# Altium project 3CHOE.PrjPcb
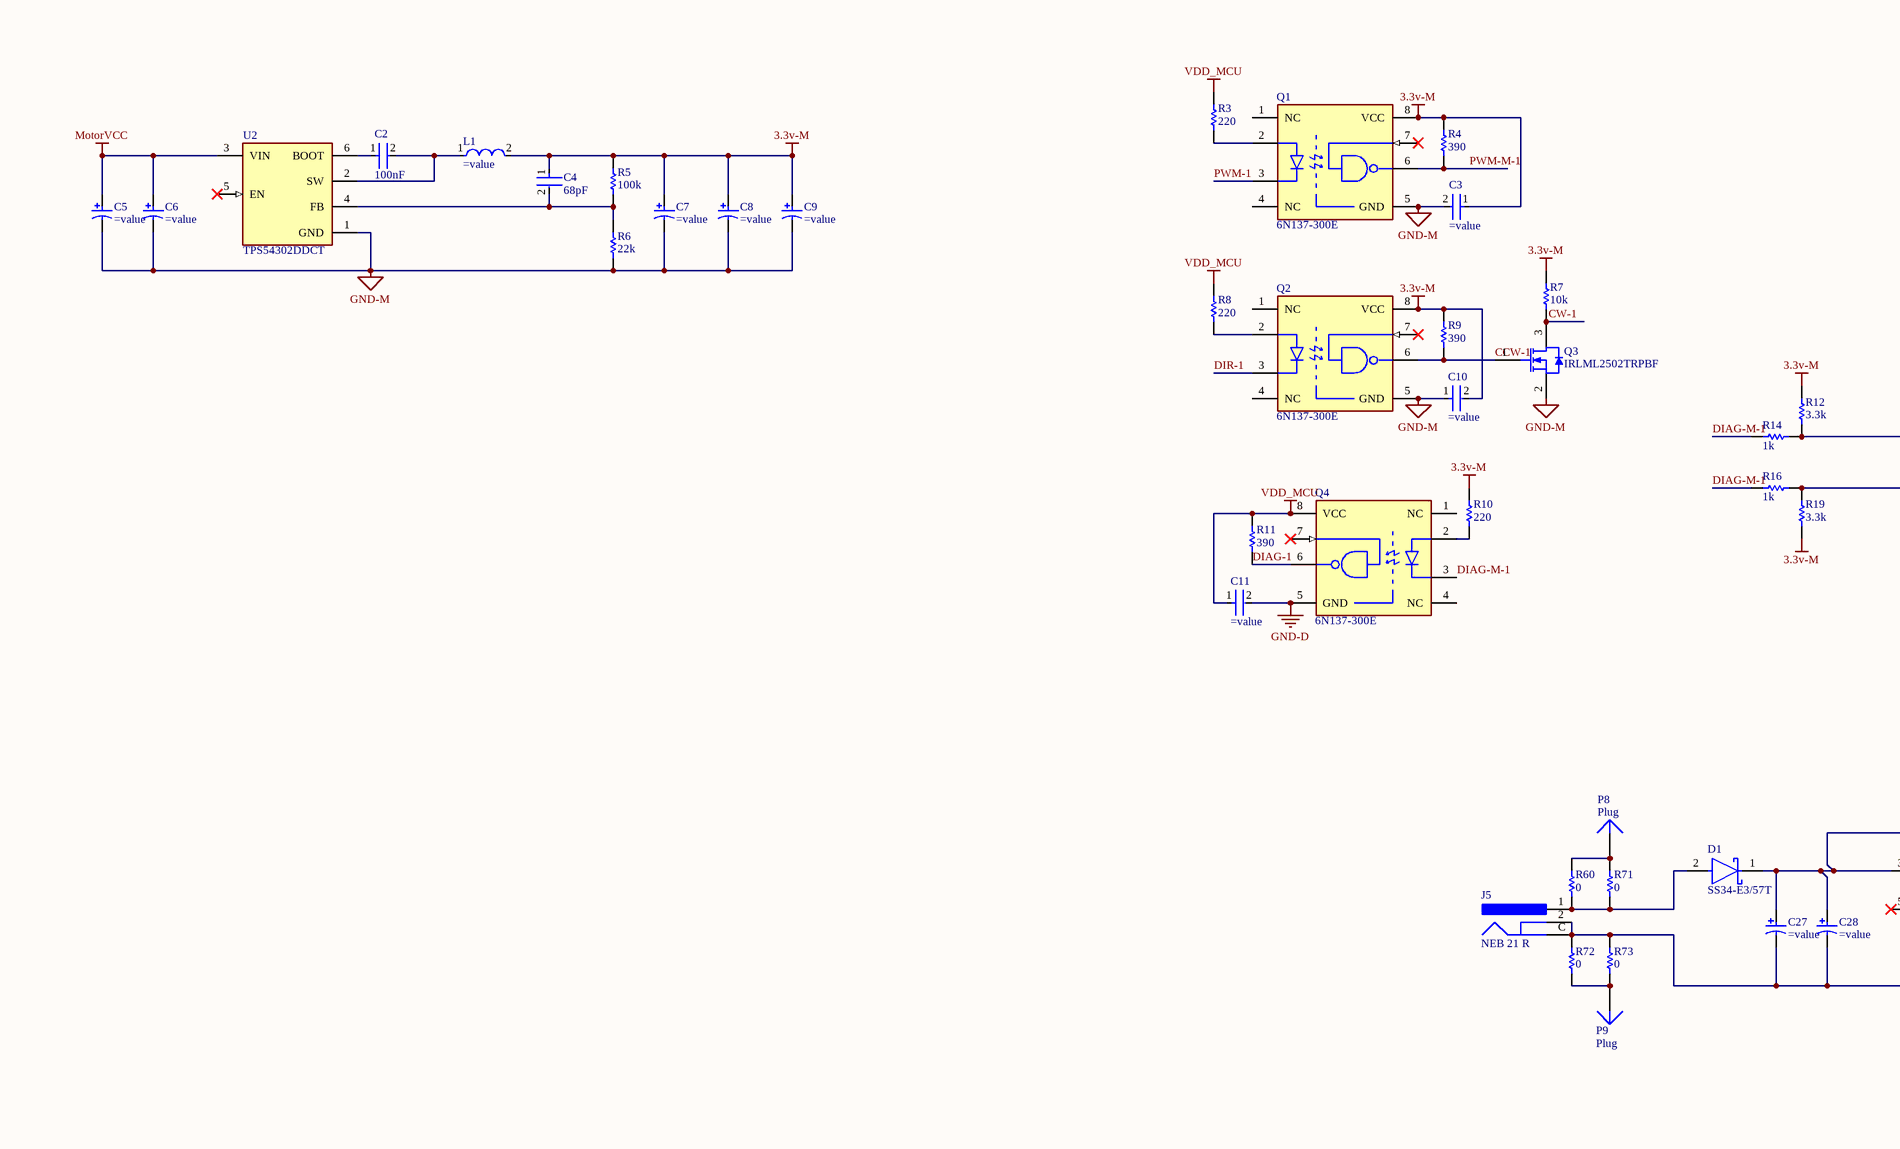
[diagram p0: 3CHOE.SchDoc, top left]
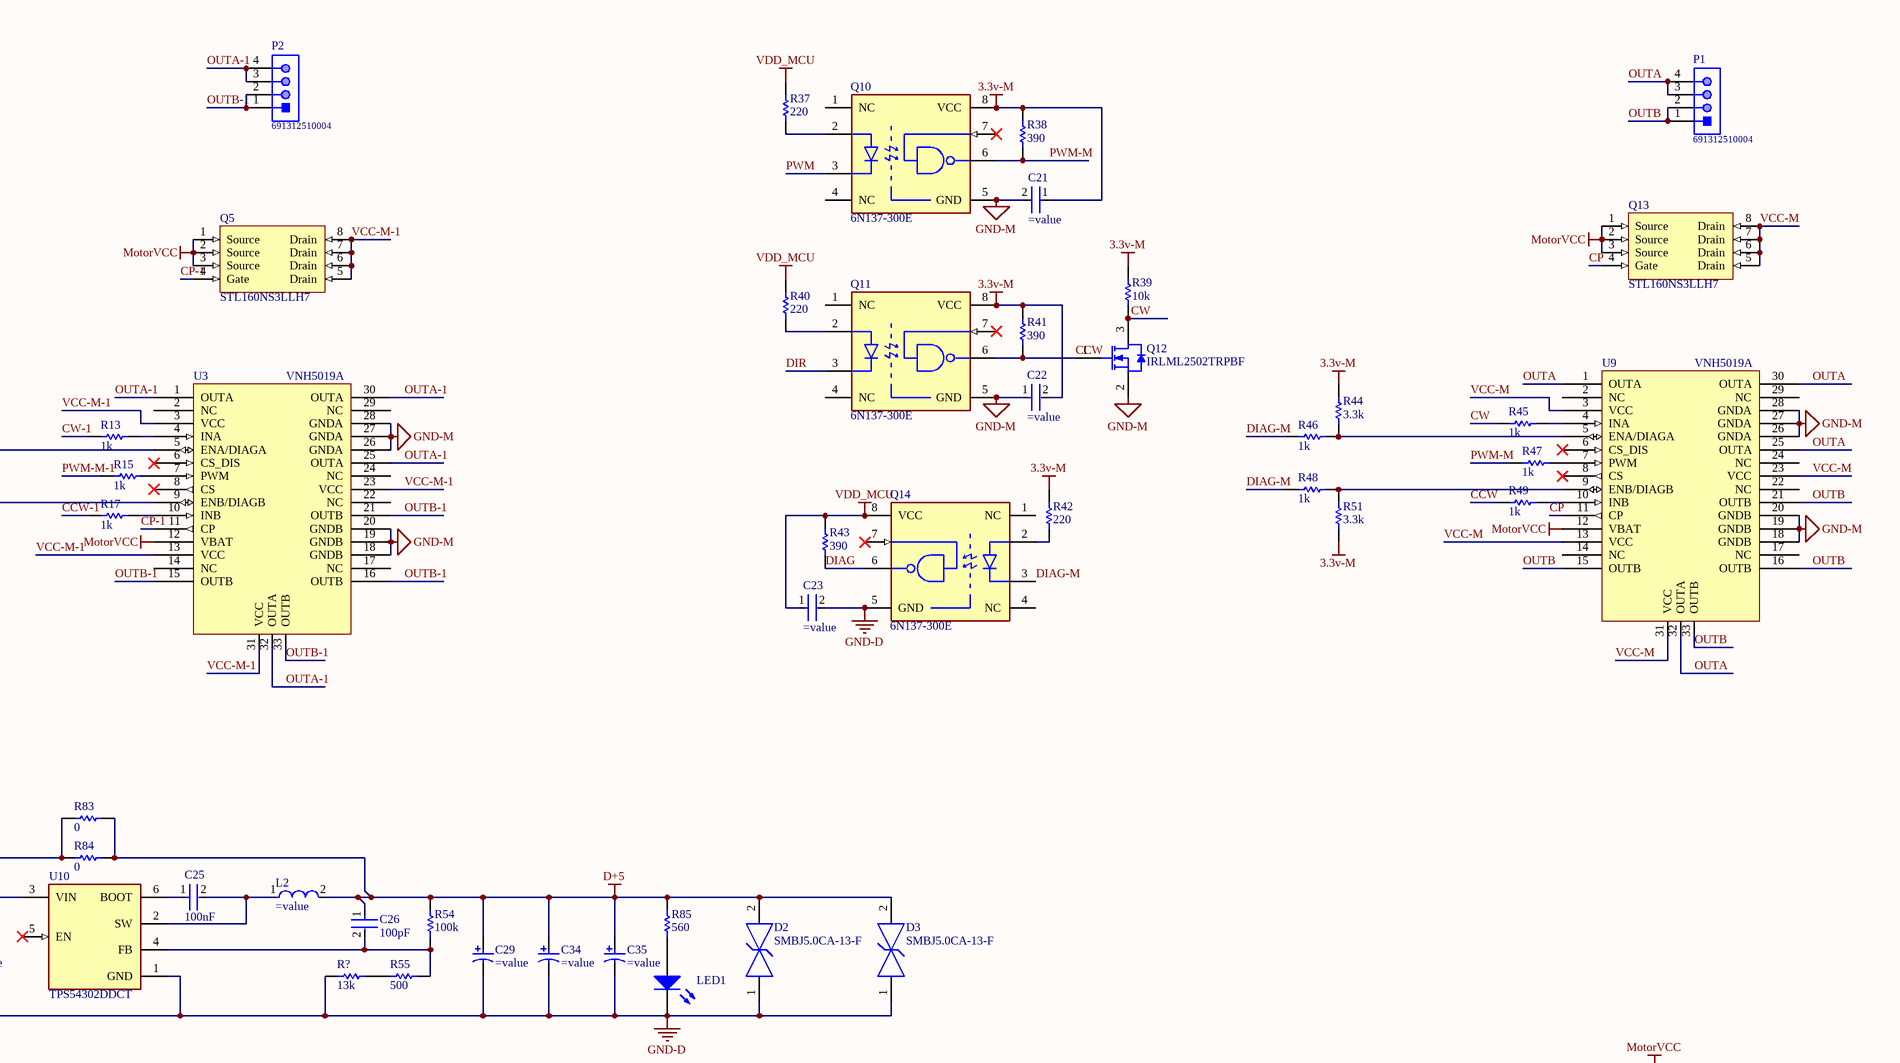
[diagram p1: 3CHOE.SchDoc, top right]
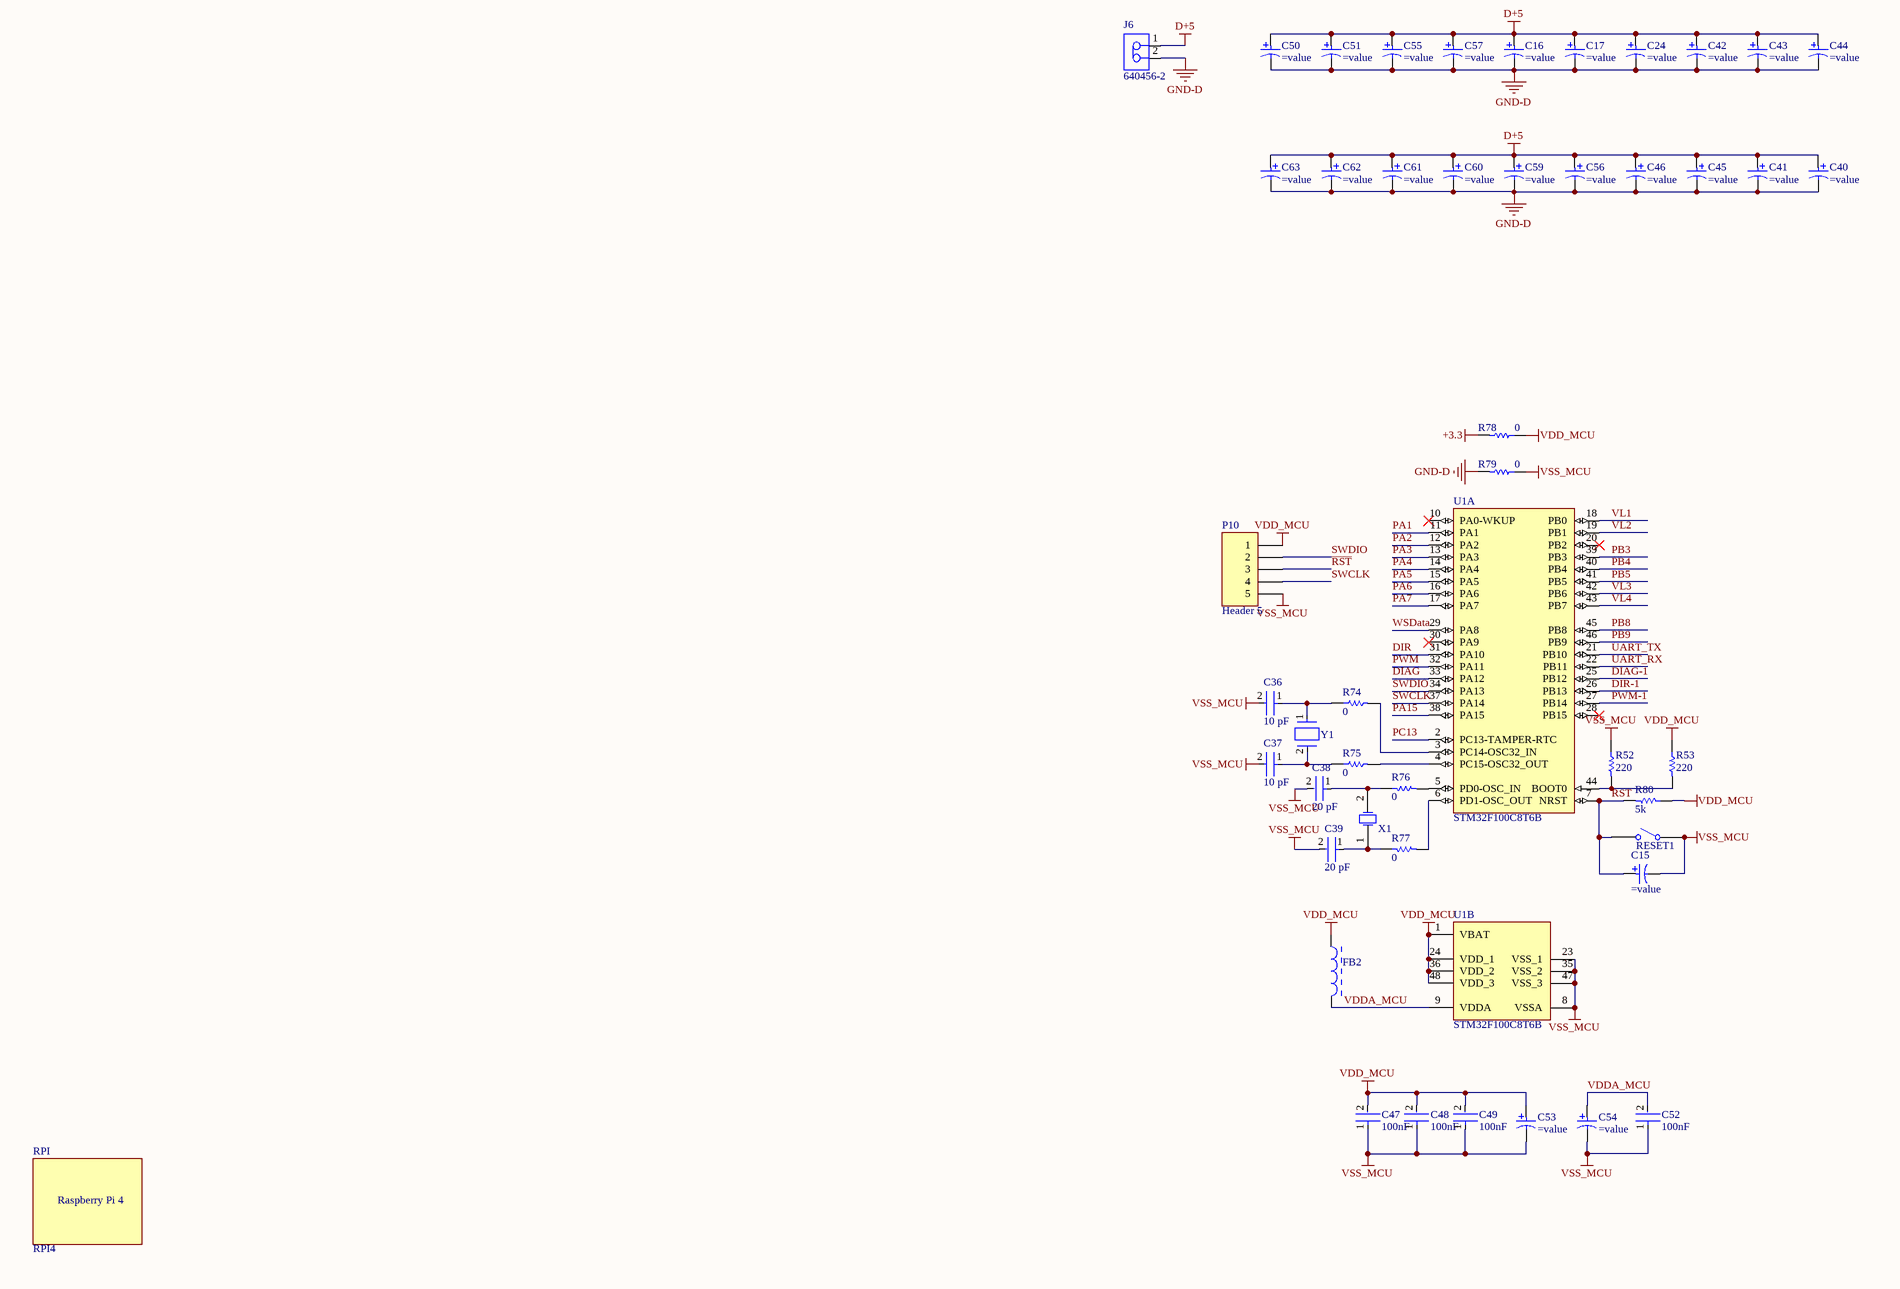
[diagram p2: 3CHOE.SchDoc, bottom left]
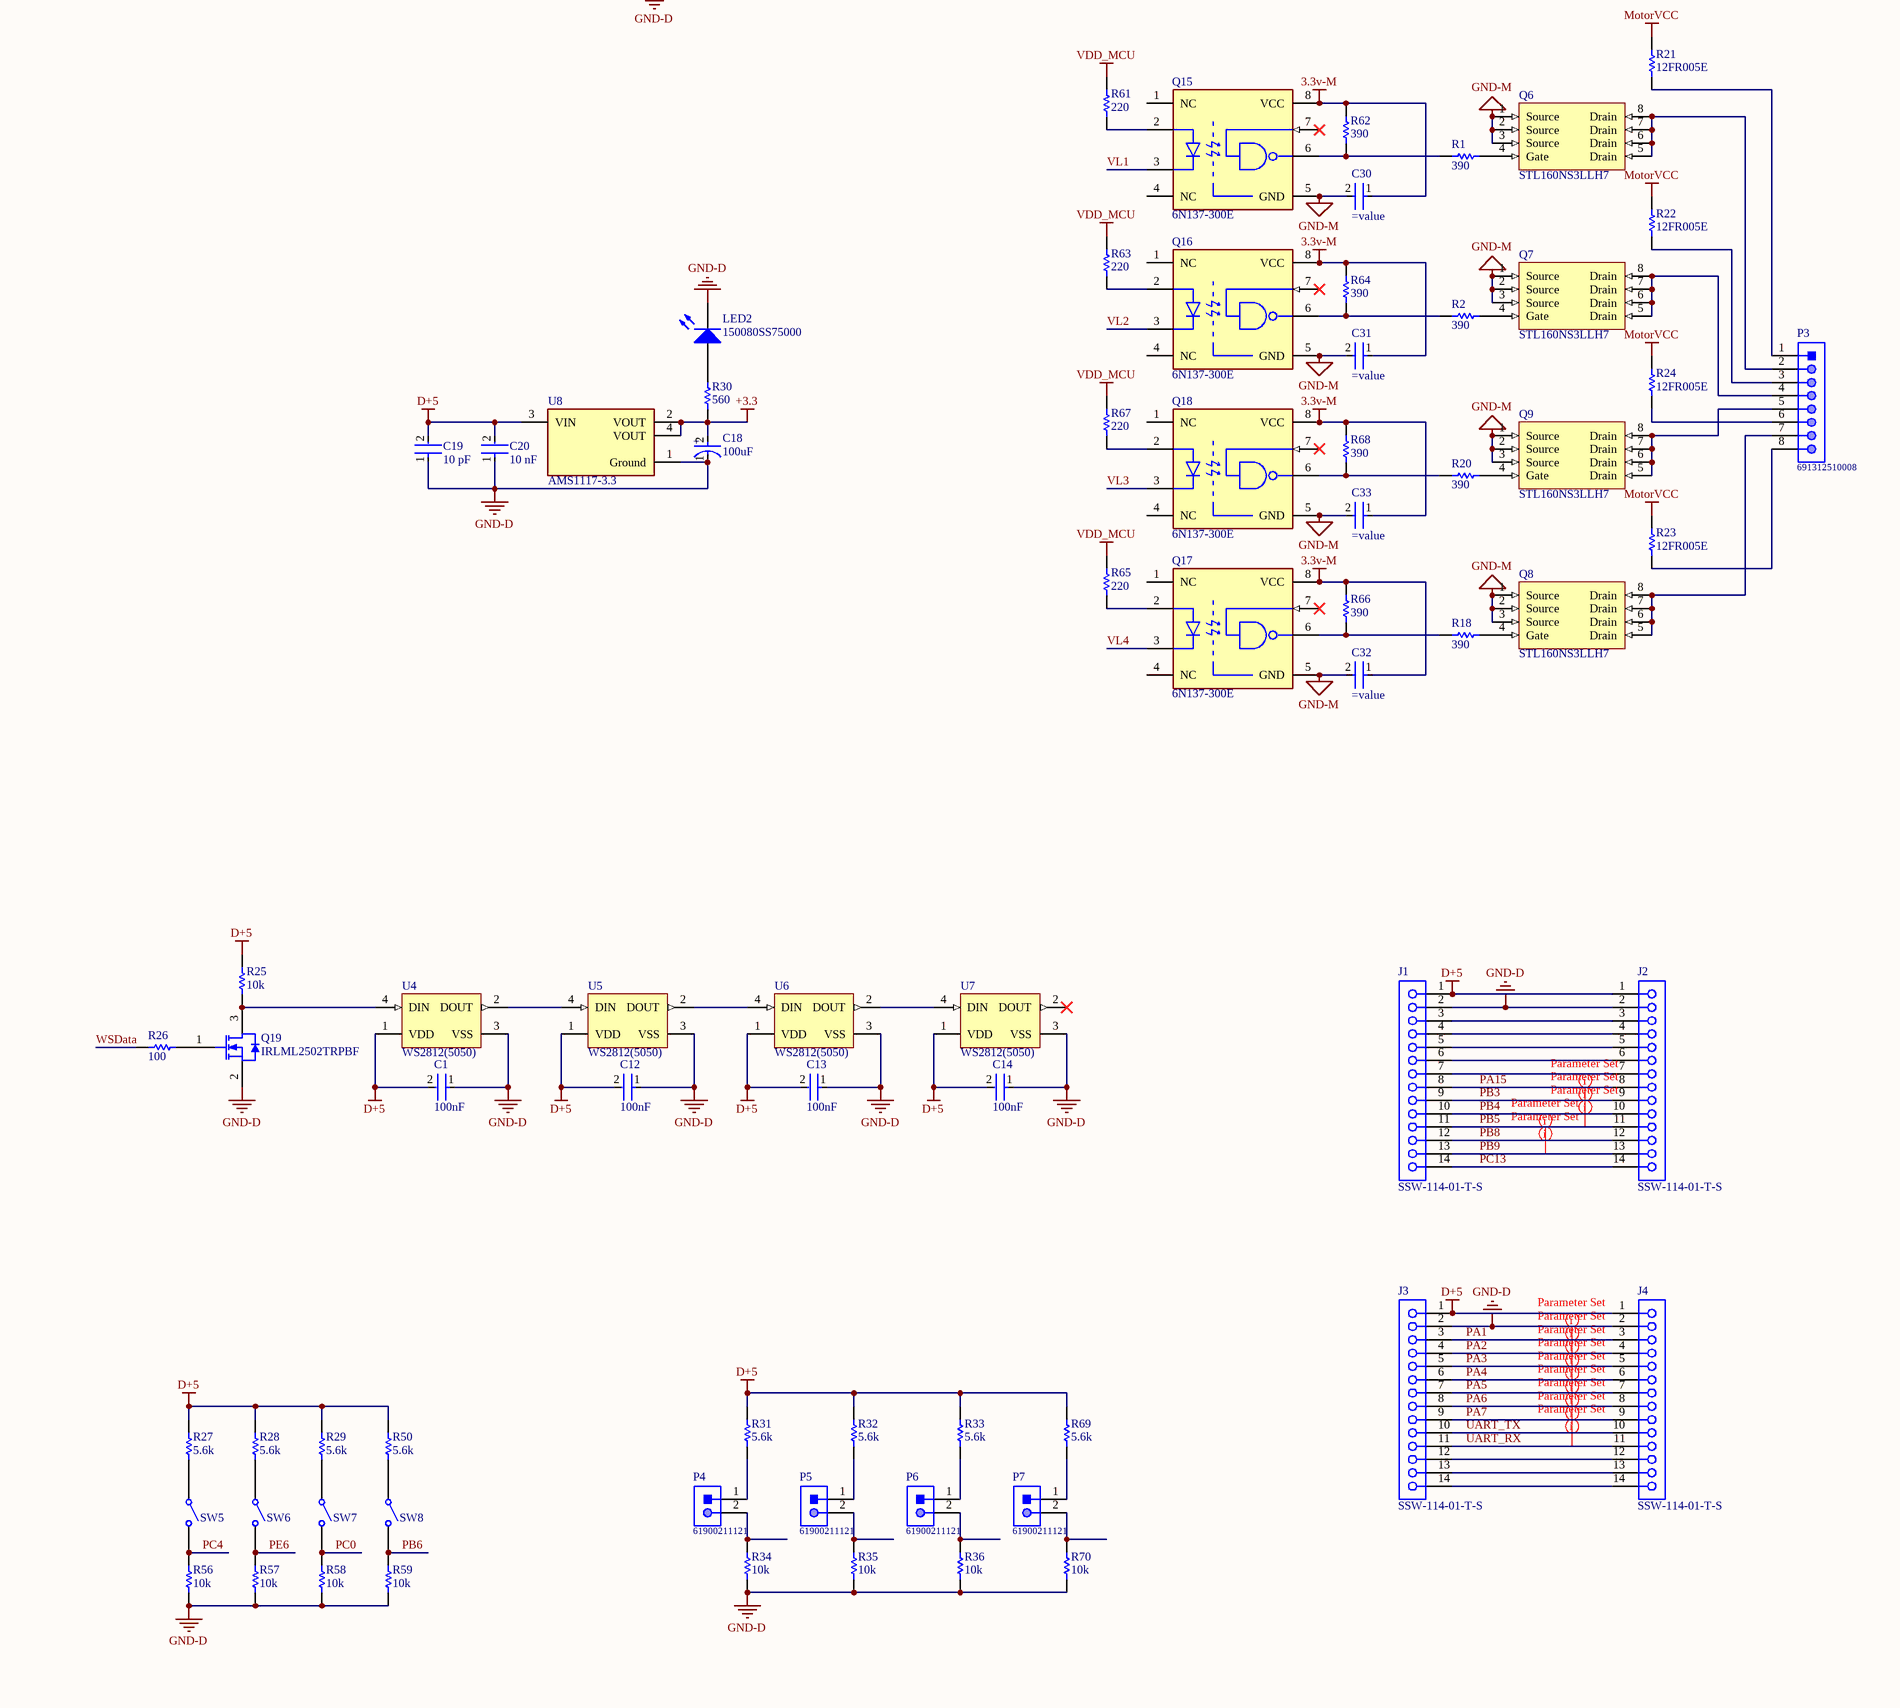
[diagram p3: 3CHOE.SchDoc, bottom right]
1 sheet, 207 parts. Net scope: global (net labels, ports and power ports of the same name join across sheets).
Board file: 3CHOE.PcbDoc

## Sheet 3CHOE.SchDoc
size A1

### Parts
C1  100nF  [FP-C0805C-DN-IPC_A]
C2  100nF  [FP-C0805C-DN-IPC_A]
C3  (no value)  [FP-C0805C-DN-MFG]
C4  68pF  [FP-C0805C-DN-IPC_A]
C5  (no value)  [KEMT-A-3216-18-2_L]
C6  (no value)  [KEMT-A-3216-18-2_L]
C7  (no value)  [KEMT-A-3216-18-2_L]
C8  (no value)  [KEMT-A-3216-18-2_L]
C9  (no value)  [KEMT-A-3216-18-2_L]
C10  (no value)  [FP-C0805C-DN-MFG]
C11  (no value)  [FP-C0805C-DN-MFG]
C12  100nF  [FP-C0805C-DN-IPC_A]
C13  100nF  [FP-C0805C-DN-IPC_A]
C14  100nF  [FP-C0805C-DN-IPC_A]
C15  (no value)  [KEMT-A-3216-18-2_L]
C16  (no value)  [PNSC-FP-V-C_V]
C17  (no value)  [PNSC-FP-V-C_V]
C18  100uF  [FP-TAJD-MFG]
C19  10 pF  [FP-C0805C-DN-MFG]
C20  10 nF  [FP-C0805C-DN-MFG]
C21  (no value)  [FP-C0805C-DN-MFG]
C22  (no value)  [FP-C0805C-DN-MFG]
C23  (no value)  [FP-C0805C-DN-MFG]
C24  (no value)  [PNSC-FP-V-C_V]
C25  100nF  [FP-C0805C-DN-IPC_A]
C26  100pF  [FP-C0805C-DN-IPC_A]
C27  (no value)  [KEMT-A-3216-18-2_L]
C28  (no value)  [KEMT-A-3216-18-2_L]
C29  (no value)  [KEMT-A-3216-18-2_L]
C30  (no value)  [FP-C0805C-DN-MFG]
C31  (no value)  [FP-C0805C-DN-MFG]
C32  (no value)  [FP-C0805C-DN-MFG]
C33  (no value)  [FP-C0805C-DN-MFG]
C34  (no value)  [KEMT-A-3216-18-2_L]
C35  (no value)  [KEMT-A-3216-18-2_L]
C36  10 pF  [FP-C0805C-DN-IPC_A]
C37  10 pF  [FP-C0805C-DN-IPC_A]
C38  20 pF  [FP-C0805C-DN-IPC_A]
C39  20 pF  [FP-C0805C-DN-IPC_A]
C40  (no value)  [PNSC-FP-V-C_V]
C41  (no value)  [PNSC-FP-V-C_V]
C42  (no value)  [PNSC-FP-V-C_V]
C43  (no value)  [PNSC-FP-V-C_V]
C44  (no value)  [PNSC-FP-V-C_V]
C45  (no value)  [PNSC-FP-V-C_V]
C46  (no value)  [PNSC-FP-V-C_V]
C47  100nF  [FP-C0805C-DN-IPC_A]
C48  100nF  [FP-C0805C-DN-IPC_A]
C49  100nF  [FP-C0805C-DN-IPC_A]
C50  (no value)  [PNSC-FP-V-C_V]
C51  (no value)  [PNSC-FP-V-C_V]
C52  100nF  [FP-C0805C-DN-IPC_A]
C53  (no value)  [KEMT-A-3216-18-2_L]
C54  (no value)  [KEMT-A-3216-18-2_L]
C55  (no value)  [PNSC-FP-V-C_V]
C56  (no value)  [PNSC-FP-V-C_V]
C57  (no value)  [PNSC-FP-V-C_V]
C59  (no value)  [PNSC-FP-V-C_V]
C60  (no value)  [PNSC-FP-V-C_V]
C61  (no value)  [PNSC-FP-V-C_V]
C62  (no value)  [PNSC-FP-V-C_V]
C63  (no value)  [PNSC-FP-V-C_V]
D1  SS34-E3/57T  [FP-95402-MFG]
D2  SMBJ5.0CA-13-F  [FP-SMB-CA-MFG]
D3  SMBJ5.0CA-13-F  [FP-SMB-CA-MFG]
FB2  BLM21RK121SN1D  [MURA-BLM21-H1-CHIP-2_V]  (value not drawn)
J1  SSW-114-01-T-S  [SMTC-SSW-114-01-X-S]
J2  SSW-114-01-T-S  [SMTC-SSW-114-01-X-S]
J3  SSW-114-01-T-S  [SMTC-SSW-114-01-X-S]
J4  SSW-114-01-T-S  [SMTC-SSW-114-01-X-S]
J5  NEB 21 R  [LUMB-NEB21R_V]
J6  640456-2  [TECO-640456-2_V]
L1  (no value)  [FP-IHLP-2525CZ-FP_2_413x3-MFG]
L2  (no value)  [FP-IHLP-2525CZ-FP_2_413x3-MFG]
LED1  150080SS75000  [0805_A]  (value not drawn)
LED2  150080SS75000  [0805_A]
P1  691312510004  [691312510004]
P2  691312510004  [691312510004]
P3  691312510008  [691312510008]
P4  61900211121  [61900211121]
P5  61900211121  [61900211121]
P6  61900211121  [61900211121]
P7  61900211121  [61900211121]
P8  Plug  [Screw-5-3.3]
P9  Plug  [Screw-5-3.3]
P10  Header 5  [STM32 PR]
Q1  6N137-300E  [FP-6N137-300E-MFG]
Q2  6N137-300E  [FP-6N137-300E-MFG]
Q3  IRLML2502TRPBF  [INTR-SOT-23-3_V]
Q4  6N137-300E  [FP-6N137-300E-MFG]
Q5  STL160NS3LLH7  [PowerFLAT™ 5x6 WF]
Q6  STL160NS3LLH7  [PowerFLAT™ 5x6 WF]
Q7  STL160NS3LLH7  [PowerFLAT™ 5x6 WF]
Q8  STL160NS3LLH7  [PowerFLAT™ 5x6 WF]
Q9  STL160NS3LLH7  [PowerFLAT™ 5x6 WF]
Q10  6N137-300E  [FP-6N137-300E-MFG]
Q11  6N137-300E  [FP-6N137-300E-MFG]
Q12  IRLML2502TRPBF  [INTR-SOT-23-3_V]
Q13  STL160NS3LLH7  [PowerFLAT™ 5x6 WF]
Q14  6N137-300E  [FP-6N137-300E-MFG]
Q15  6N137-300E  [FP-6N137-300E-MFG]
Q16  6N137-300E  [FP-6N137-300E-MFG]
Q17  6N137-300E  [FP-6N137-300E-MFG]
Q18  6N137-300E  [FP-6N137-300E-MFG]
Q19  IRLML2502TRPBF  [INTR-SOT-23-3_V]
R1  390  [RESC2013X60X35NL10T20]
R2  390  [RESC2013X60X35NL10T20]
R3  220  [RESC2013X60X35NL10T20]
R4  390  [RESC2013X60X35NL10T20]
R5  100k  [RESC2013X60X35NL10T20]
R6  22k  [RESC2013X60X35NL10T20]
R7  10k  [RESC2013X60X35NL10T20]
R8  220  [RESC2013X60X35NL10T20]
R9  390  [RESC2013X60X35NL10T20]
R10  220  [RESC2013X60X35NL10T20]
R11  390  [RESC2013X60X35NL10T20]
R12  3.3k  [RESC2013X60X35NL10T20]
R13  1k  [RESC2013X60X35NL10T20]
R14  1k  [RESC2013X60X35NL10T20]
R15  1k  [RESC2013X60X35NL10T20]
R16  1k  [RESC2013X60X35NL10T20]
R17  1k  [RESC2013X60X35NL10T20]
R18  390  [RESC2013X60X35NL10T20]
R19  3.3k  [RESC2013X60X35NL10T20]
R20  390  [RESC2013X60X35NL10T20]
R21  12FR005E  [RESA90-1060X240]
R22  12FR005E  [RESA90-1060X240]
R23  12FR005E  [RESA90-1060X240]
R24  12FR005E  [RESA90-1060X240]
R25  10k  [RESC2013X60X35NL10T20]
R26  100  [RESC2013X60X35NL10T20]
R27  5.6k  [RESC2013X60X35NL10T20]
R28  5.6k  [RESC2013X60X35NL10T20]
R29  5.6k  [RESC2013X60X35NL10T20]
R30  560  [RESC2013X60X35NL10T20]
R31  5.6k  [RESC2013X60X35NL10T20]
R32  5.6k  [RESC2013X60X35NL10T20]
R33  5.6k  [RESC2013X60X35NL10T20]
R34  10k  [RESC2013X60X35NL10T20]
R35  10k  [RESC2013X60X35NL10T20]
R36  10k  [RESC2013X60X35NL10T20]
R37  220  [RESC2013X60X35NL10T20]
R38  390  [RESC2013X60X35NL10T20]
R39  10k  [RESC2013X60X35NL10T20]
R40  220  [RESC2013X60X35NL10T20]
R41  390  [RESC2013X60X35NL10T20]
R42  220  [RESC2013X60X35NL10T20]
R43  390  [RESC2013X60X35NL10T20]
R44  3.3k  [RESC2013X60X35NL10T20]
R45  1k  [RESC2013X60X35NL10T20]
R46  1k  [RESC2013X60X35NL10T20]
R47  1k  [RESC2013X60X35NL10T20]
R48  1k  [RESC2013X60X35NL10T20]
R49  1k  [RESC2013X60X35NL10T20]
R50  5.6k  [RESC2013X60X35NL10T20]
R51  3.3k  [RESC2013X60X35NL10T20]
R52  220  [RESC2013X60X35NL10T20]
R53  220  [RESC2013X60X35NL10T20]
R54  100k  [RESC2013X60X35NL10T20]
R55  500  [RESC2013X60X35NL10T20]
R56  10k  [RESC2013X60X35NL10T20]
R57  10k  [RESC2013X60X35NL10T20]
R58  10k  [RESC2013X60X35NL10T20]
R59  10k  [RESC2013X60X35NL10T20]
R60  0  [RESC2013X60X35NL10T20]
R61  220  [RESC2013X60X35NL10T20]
R62  390  [RESC2013X60X35NL10T20]
R63  220  [RESC2013X60X35NL10T20]
R64  390  [RESC2013X60X35NL10T20]
R65  220  [RESC2013X60X35NL10T20]
R66  390  [RESC2013X60X35NL10T20]
R67  220  [RESC2013X60X35NL10T20]
R68  390  [RESC2013X60X35NL10T20]
R69  5.6k  [RESC2013X60X35NL10T20]
R70  10k  [RESC2013X60X35NL10T20]
R71  0  [RESC2013X60X35NL10T20]
R72  0  [RESC2013X60X35NL10T20]
R73  0  [RESC2013X60X35NL10T20]
R74  0  [RESC2013X60X35NL10T20]
R75  0  [RESC2013X60X35NL10T20]
R76  0  [RESC2013X60X35NL10T20]
R77  0  [RESC2013X60X35NL10T20]
R78  0  [RESC2013X60X35NL10T20]
R79  0  [RESC2013X60X35NL10T20]
R80  5k  [RESC2013X60X35NL10T20]
R83  0  [RESC2013X60X35NL10T20]
R84  0  [RESC2013X60X35NL10T20]
R85  560  [RESC2013X60X35NL10T20]
R?  13k  [RESC2013X60X35NL10T20]
RESET1  434113025826  [434113025826]  (value not drawn)
RPI  RPI4  [Rpi4]
SW5  434113025826  [434113025826]  (value not drawn)
SW6  434113025826  [434113025826]  (value not drawn)
SW7  434113025826  [434113025826]  (value not drawn)
SW8  434113025826  [434113025826]  (value not drawn)
U1  STM32F100C8T6B  [STM-LQFP48_L]  (parts A,B of 2)
U2  TPS54302DDCT  [FP-DDC0006A-MFG]
U3  VNH5019A  [MultiPowerSO-30]
U4  WS2812(5050)  [ADA-RGB-1655_V]
U5  WS2812(5050)  [ADA-RGB-1655_V]
U6  WS2812(5050)  [ADA-RGB-1655_V]
U7  WS2812(5050)  [ADA-RGB-1655_V]
U8  AMS1117-3.3  [FP-AMS1117-IPC_C]
U9  VNH5019A  [MultiPowerSO-30]
U10  TPS54302DDCT  [FP-DDC0006A-MFG]
X1  ATS16ASM-1  [CTS-ATS-SM-XTAL-2]  (value not drawn)
Y1  9HT10-32.768KDZY-T  [FP-9HT10-MFG]  (value not drawn)

### Nets
3.3v-M: C3.1 C4.1 C7.1 C8.1 C9.1 C10.2 C21.1 C22.2 C30.1 C31.1 C32.1 C33.1 L1.2 Q1.8(VCC) Q2.8(VCC) Q10.8(VCC) Q11.8(VCC) Q15.8(VCC) Q16.8(VCC) Q17.8(VCC) Q18.8(VCC) R4.2 R5.1 R7.2 R9.2 R10.1 R12.1 R19.1 R38.2 R39.2 R41.2 R42.1 R44.1 R51.1 R62.2 R64.2 R66.2 R68.2
+3.3: C18.2(A) R30.2 R78.2 U8.2(VOUT) U8.4(VOUT)
D+5: C1.2 C12.2 C13.2 C14.2 C16.1 C17.1 C19.2 C20.2 C24.1 C26.1 C29.1 C34.1 C35.1 C40.1 C41.1 C42.1 C43.1 C44.1 C45.1 C46.1 C50.1 C51.1 C55.1 C56.1 C57.1 C59.1 C60.1 C61.1 C62.1 C63.1 D2.2 D3.2 J1.1 J2.1 J3.1 J4.1 J6.1 L2.2 R25.2 R27.2 R28.2 R29.2 R31.2 R32.2 R33.2 R50.2 R54.1 R69.2 R83.2 R84.2 R85.2 U4.1(VDD) U5.1(VDD) U6.1(VDD) U7.1(VDD) U8.3(VIN)
GND-D: C1.1 C11.2 C12.1 C13.1 C14.1 C16.2 C17.2 C18.1(C) C19.1 C20.1 C23.2 C24.2 C27.2 C28.2 C29.2 C34.2 C35.2 C40.2 C41.2 C42.2 C43.2 C44.2 C45.2 C46.2 C50.2 C51.2 C55.2 C56.2 C57.2 C59.2 C60.2 C61.2 C62.2 C63.2 D2.1 D3.1 J1.2 J2.2 J3.2 J4.2 J5.2 J5.C J6.2 LED1.1(K) LED2.1(K) Q4.5(GND) Q14.5(GND) Q19.2(S) R34.1 R35.1 R36.1 R56.1 R57.1 R58.1 R59.1 R70.1 R72.1 R73.1 R79.2 R?.1 U4.3(VSS) U5.3(VSS) U6.3(VSS) U7.3(VSS) U8.1(Ground) U10.1(GND)
GND-M: C3.2 C5.2 C6.2 C7.2 C8.2 C9.2 C10.1 C21.2 C22.1 C30.2 C31.2 C32.2 C33.2 Q1.5(GND) Q2.5(GND) Q3.2(S) Q6.1(Source) Q6.2(Source) Q6.3(Source) Q7.1(Source) Q7.2(Source) Q7.3(Source) Q8.1(Source) Q8.2(Source) Q8.3(Source) Q9.1(Source) Q9.2(Source) Q9.3(Source) Q10.5(GND) Q11.5(GND) Q12.2(S) Q15.5(GND) Q16.5(GND) Q17.5(GND) Q18.5(GND) R6.2 U2.1(GND) U3.18(GNDB) U3.19(GNDB) U3.20(GNDB) U3.26(GNDA) U3.27(GNDA) U3.28(GNDA) U9.18(GNDB) U9.19(GNDB) U9.20(GNDB) U9.26(GNDA) U9.27(GNDA) U9.28(GNDA)
MotorVCC: C5.1 C6.1 Q5.1(Source) Q5.2(Source) Q5.3(Source) Q13.1(Source) Q13.2(Source) Q13.3(Source) R21.2 R22.2 R23.2 R24.2 U2.3(VIN) U3.12(VBAT) U9.12(VBAT)
VDD_MCU: C11.1 C23.1 C47.2 C48.2 C49.2 C53.1 FB2.1 P10.1 Q4.8(VCC) Q14.8(VCC) R3.1 R8.1 R11.1 R37.1 R40.1 R43.1 R53.1 R61.1 R63.1 R65.1 R67.1 R78.1 R80.1 U1.1(VBAT) U1.24(VDD_1) U1.36(VDD_2) U1.48(VDD_3)
VSS_MCU: C15.2 C36.2 C37.2 C38.2 C39.2 C47.1 C48.1 C49.1 C52.1 C53.2 C54.2 P10.5 R52.1 R79.1 RESET1.1 U1.8(VSSA) U1.23(VSS_1) U1.35(VSS_2) U1.47(VSS_3)
~{RST}: C15.1 P10.3 R80.2 RESET1.2 U1.7(NRST)
CCW: Q11.6(VO) Q12.1(G) R41.1 R49.2
CCW-1: Q2.6(VO) Q3.1(G) R9.1 R17.2
CP: Q13.4(Gate) U9.11(CP)
CP-1: Q5.4(Gate) U3.11(CP)
CW: Q12.3(D) R39.1 R45.2
CW-1: Q3.3(D) R7.1 R13.2
DIAG: Q14.6(VO) R43.2 U1.33(PA12)
DIAG-1: Q4.6(VO) R11.2 U1.25(PB12)
DIAG-M: Q14.3(C) R46.2 R48.2
DIAG-M-1: Q4.3(C) R14.2 R16.2
DIR: Q11.3(C) U1.31(PA10)
DIR-1: Q2.3(C) U1.26(PB13)
OUTA: P1.3 P1.4 U9.1(OUTA) U9.25(OUTA) U9.30(OUTA) U9.32(OUTA)
OUTA-1: P2.3 P2.4 U3.1(OUTA) U3.25(OUTA) U3.30(OUTA) U3.32(OUTA)
OUTB: P1.1 P1.2 U9.15(OUTB) U9.16(OUTB) U9.21(OUTB) U9.33(OUTB)
OUTB-1: P2.1 P2.2 U3.15(OUTB) U3.16(OUTB) U3.21(OUTB) U3.33(OUTB)
PA1: J3.3 J4.3 U1.11(PA1)
PA2: J3.4 J4.4 U1.12(PA2)
PA3: J3.5 J4.5 U1.13(PA3)
PA4: J3.6 J4.6 U1.14(PA4)
PA5: J3.7 J4.7 U1.15(PA5)
PA6: J3.8 J4.8 U1.16(PA6)
PA7: J3.9 J4.9 U1.17(PA7)
PA15: J1.8 J2.8 U1.38(PA15)
PB3: J1.9 J2.9 U1.39(PB3)
PB4: J1.10 J2.10 U1.40(PB4)
PB5: J1.11 J2.11 U1.41(PB5)
PB6: R59.2 SW8.2
PB8: J1.12 J2.12 U1.45(PB8)
PB9: J1.13 J2.13 U1.46(PB9)
PC0: R58.2 SW7.2
PC4: R56.2 SW5.2
PC13: J1.14 J2.14 U1.2(PC13-TAMPER-RTC)
PE6: R57.2 SW6.2
PWM: Q10.3(C) U1.32(PA11)
PWM-1: Q1.3(C) U1.27(PB14)
PWM-M: Q10.6(VO) R38.1 R47.2
PWM-M-1: Q1.6(VO) R4.1 R15.2
SWCLK: P10.4 U1.37(PA14)
SWDIO: P10.2 U1.34(PA13)
UART_RX: J3.11 J4.11 U1.22(PB11)
UART_TX: J3.10 J4.10 U1.21(PB10)
VCC-M: Q13.5(Drain) Q13.6(Drain) Q13.7(Drain) Q13.8(Drain) U9.3(VCC) U9.13(VCC) U9.23(VCC) U9.31(VCC)
VCC-M-1: Q5.5(Drain) Q5.6(Drain) Q5.7(Drain) Q5.8(Drain) U3.3(VCC) U3.13(VCC) U3.23(VCC) U3.31(VCC)
VDDA_MCU: C52.2 C54.1 FB2.2 U1.9(VDDA)
VL1: Q15.3(C) U1.18(PB0)
VL2: Q16.3(C) U1.19(PB1)
VL3: Q18.3(C) U1.42(PB6)
VL4: Q17.3(C) U1.43(PB7)
WSData: R26.2 U1.29(PA8)
NetC2_1: C2.1 U2.6(BOOT)
NetC2_2: C2.2 L1.1 U2.2(SW)
NetC4_2: C4.2 R5.2 R6.1 U2.4(FB)
NetC25_1: C25.1 U10.6(BOOT)
NetC25_2: C25.2 L2.1 U10.2(SW)
NetC26_2: C26.2 R54.2 R55.2 U10.4(FB)
NetC27_1: C27.1 C28.1 D1.1(C) R83.1 R84.1 U10.3(VIN)
NetC36_1: C36.1 R74.1 Y1.1
NetC37_1: C37.1 R75.1 Y1.2
NetC38_1: C38.1 R76.1 X1.2(X2)
NetC39_1: C39.1 R77.1 X1.1(X1)
NetD1_2: D1.2(A) J5.1 R60.2 R71.2
NetJ1_3: J1.3 J2.3
NetJ1_4: J1.4 J2.4
NetJ1_5: J1.5 J2.5
NetJ1_6: J1.6 J2.6
NetJ1_7: J1.7 J2.7
NetJ3_12: J3.12 J4.12
NetJ3_13: J3.13 J4.13
NetJ3_14: J3.14 J4.14
NetLED1_2: LED1.2(A) R85.1
NetLED2_2: LED2.2(A) R30.1
NetP3_1: P3.1 R21.1
NetP3_2: P3.2 Q6.5(Drain) Q6.6(Drain) Q6.7(Drain) Q6.8(Drain)
NetP3_3: P3.3 R22.1
NetP3_4: P3.4 Q7.5(Drain) Q7.6(Drain) Q7.7(Drain) Q7.8(Drain)
NetP3_5: P3.5 Q9.5(Drain) Q9.6(Drain) Q9.7(Drain) Q9.8(Drain)
NetP3_6: P3.6 R24.1
NetP3_7: P3.7 Q8.5(Drain) Q8.6(Drain) Q8.7(Drain) Q8.8(Drain)
NetP3_8: P3.8 R23.1
NetP4_1: P4.1 R31.1
NetP4_2: P4.2 R34.2
NetP5_1: P5.1 R32.1
NetP5_2: P5.2 R35.2
NetP6_1: P6.1 R33.1
NetP6_2: P6.2 R36.2
NetP7_1: P7.1 R69.1
NetP7_2: P7.2 R70.2
NetP8_1: P8.1 R60.1 R71.1
NetP9_1: P9.1 R72.2 R73.2
NetQ1_2: Q1.2(A) R3.2
NetQ2_2: Q2.2(A) R8.2
NetQ4_2: Q4.2(A) R10.2
NetQ6_4: Q6.4(Gate) R1.1
NetQ7_4: Q7.4(Gate) R2.1
NetQ8_4: Q8.4(Gate) R18.1
NetQ9_4: Q9.4(Gate) R20.1
NetQ10_2: Q10.2(A) R37.2
NetQ11_2: Q11.2(A) R40.2
NetQ14_2: Q14.2(A) R42.2
NetQ15_2: Q15.2(A) R61.2
NetQ15_6: Q15.6(VO) R1.2 R62.1
NetQ16_2: Q16.2(A) R63.2
NetQ16_6: Q16.6(VO) R2.2 R64.1
NetQ17_2: Q17.2(A) R65.2
NetQ17_6: Q17.6(VO) R18.2 R66.1
NetQ18_2: Q18.2(A) R67.2
NetQ18_6: Q18.6(VO) R20.2 R68.1
NetQ19_1: Q19.1(G) R26.1
NetQ19_3: Q19.3(D) R25.1 U4.4(DIN)
NetR12_2: R12.2 R14.1 U3.5(ENA/DIAGA)
NetR13_1: R13.1 U3.4(INA)
NetR15_1: R15.1 U3.7(PWM)
NetR16_1: R16.1 R19.2 U3.9(ENB/DIAGB)
NetR17_1: R17.1 U3.10(INB)
NetR27_1: R27.1 SW5.1
NetR28_1: R28.1 SW6.1
NetR29_1: R29.1 SW7.1
NetR44_2: R44.2 R46.1 U9.5(ENA/DIAGA)
NetR45_1: R45.1 U9.4(INA)
NetR47_1: R47.1 U9.7(PWM)
NetR48_1: R48.1 R51.2 U9.9(ENB/DIAGB)
NetR49_1: R49.1 U9.10(INB)
NetR50_1: R50.1 SW8.1
NetR52_2: R52.2 R53.2 U1.44(BOOT0)
NetR55_1: R55.1 R?.2
NetR74_2: R74.2 U1.3(PC14-OSC32_IN)
NetR75_2: R75.2 U1.4(PC15-OSC32_OUT)
NetR76_2: R76.2 U1.5(PD0-OSC_IN)
NetR77_2: R77.2 U1.6(PD1-OSC_OUT)
NetU4_2: U4.2(DOUT) U5.4(DIN)
NetU5_2: U5.2(DOUT) U6.4(DIN)
NetU6_2: U6.2(DOUT) U7.4(DIN)

Not connected (* = marked no-connect by the designer): Q1 1(NC) 4(NC) 7(VE)*; Q2 1(NC) 4(NC) 7(VE)*; Q4 1(NC) 4(NC) 7(VE)*; Q10 1(NC) 4(NC) 7(VE)*; Q11 1(NC) 4(NC) 7(VE)*; Q14 1(NC) 4(NC) 7(VE)*; Q15 1(NC) 4(NC) 7(VE)*; Q16 1(NC) 4(NC) 7(VE)*; Q17 1(NC) 4(NC) 7(VE)*; Q18 1(NC) 4(NC) 7(VE)*; U1 10(PA0-WKUP)* 20(PB2)* 28(PB15)* 30(PA9)*; U2 5(EN)*; U3 2(NC) 6(CS_DIS)* 8(CS)* 14(NC) 17(NC) 22(NC) 24(NC) 29(NC); U7 2(DOUT)*; U9 2(NC) 6(CS_DIS)* 8(CS)* 14(NC) 17(NC) 22(NC) 24(NC) 29(NC); U10 5(EN)*

### Layout directives
net class Port2; rule Length Constraint [Min Length = 48mm    Max Length = 50mm]; rule Matched Net Lengths [Tolerance = 2mm]: PA1, PA2, PA3, PA4, PA5, PA6, PA7, UART_RX, UART_TX
net class Port1SPI; rule Length Constraint [Min Length = 49mm    Max Length = 51mm]; rule Matched Net Lengths [Tolerance = 2mm]: PB3, PB4, PB5
net class Port1; rule Matched Net Lengths [Tolerance = 1mm]; rule Length Constraint [Min Length = 42mm    Max Length = 43mm]: PB8, PB9

### Notes on the sheet
- Title
- Size:
- Date:
- File:
- A1
- Number:
- Time:
- Revision:
- Sheet
- of
- (in symbol CMP-04424-000013-1) +
- (in symbol RPI4) Raspberry Pi 4

### Library data of the parts
C1 C2 C4 C12-C14 C19 C20 C25 C26 C36-C39 C47-C49 C52 = CMP-03020-024154-1: CAP CER 0.1UF 10V 10% X7R 0805; Manufacturer: KEMET; Manufacturer Part Number: C0805C104K8RACTU; Temperature Coefficient: 30ppm/°C; Tolerance: 0.1; Capacitance: 0.10 μF; Material: Ceramic; Ipc Land Pattern Name: CAPC200125X78; Voltage Rating: 10 V; Temperature: -55°C to +125°C; Octopart: https://octopart.com/c0805c104k8ractu-kemet-9139201; RoHS: TRUE; Category: Cap; Temperature Range High: +125°C; Device Class L1: Passive Components; Mouser Description: Multilayer Ceramic Capacitors MLCC - SMD/SMT 10volts 0.1uF X7R 10%; Device Class L2: Capacitors; Automotive: No; Temperature Range Low: -55°C; Temperature Characteristic: X7R; Lead Free: Yes; Device Class L3: Ceramic Capacitors; Height: 0.88mm; ComponentLink2URL: https://content.kemet.com/datasheets/KEM_C1003_C0G_SMD.pdf; Digikey Description: CAP CER 0.1UF 10V 10% X7R 0805; Package: C0805C-DN; ComponentLink2Description: Datasheet
  C1 C2 C12-C14 C25 C47-C49 C52: Value: 100nF
  C4: Value: 68pF
  C19 C36 C37: Value: 10 pF
  C20: Value: 10 nF
  C26: Value: 100pF
  C38 C39: Value: 20 pF
C3 C10 C11 C21-C23 C30-C33 = CMP-03020-024154-1: CAP CER 0.1UF 10V 10% X7R 0805; Manufacturer: KEMET; Manufacturer Part Number: C0805C104K8RACTU; Temperature Coefficient: 30ppm/°C; Tolerance: 0.1; Capacitance: 100nF; Material: Ceramic; Value: 100nF; Ipc Land Pattern Name: CAPC200125X78; Voltage Rating: 10 V; Temperature: -55°C to +125°C; Octopart: https://octopart.com/c0805c104k8ractu-kemet-9139201; RoHS: TRUE; Category: Cap; Temperature Range High: +125°C; Device Class L1: Passive Components; Mouser Description: Multilayer Ceramic Capacitors MLCC - SMD/SMT 10volts 0.1uF X7R 10%; Device Class L2: Capacitors; Automotive: No; Temperature Range Low: -55°C; Temperature Characteristic: X7R; Lead Free: Yes; Device Class L3: Ceramic Capacitors; Height: 0.88mm; ComponentLink2URL: https://content.kemet.com/datasheets/KEM_C1003_C0G_SMD.pdf; Digikey Description: CAP CER 0.1UF 10V 10% X7R 0805; Package: C0805C-DN; ComponentLink2Description: Datasheet
C5-C9 C27 C28 = CMP-2000-05172-1: Capacitor, Tantalum, 10 uF, +/- 10%, 10 V, -55 to 125 degC, 2-Pin SMD (1206), RoHS, Tape and Reel; Manufacturer Size Code: A; Manufacturer: Kemet; Type: Molded; Online Catalog: T491Series; Other Names: 399-3684-2; Voltage - Rated: 10V; Lifetime @ Temp.: 2000Hrs@85degC; Product Training Modules: CapacitorBasics-TypicalUsesforCapacitorsDeratingGuidelinesforSurfaceMountTantalumCapacitors; ESR (Equivalent Series Resistance): 3.8Ohm; Capacitance: 10uF; Catalog Drawings: T49x,T5xxSeries_A-side1T49x,T5xxSeries_A,B-side2T49x,T5xxSeries_A,SBottom; value: 10uF; Family: TantalumCapacitors; Manufacturer URL: http://www.kemet.com/; Datasheet URL: http://www.farnell.com/datasheets/1824869.pdf; Package Reference: 1206; Packaging: Tape&Reel(TR); Series: T491; Operating Temperature: -55degC~125degC; Mounting Type: SurfaceMount; Height - Seated (Max): 0.071"(1.80mm); Package / Case: 1206(3216Metric); Package Description: 2-Pin Surface Mount Device, Body 3.2 x 1.6 mm; Features: GeneralPurpose; Tolerance: ±10%; Lead Spacing: -; Size / Dimension: 0.126"Lx0.063"W(3.20mmx1.60mm); Standard Package: 2,000; Datasheet Version: Apr-14; Category: Capacitors
C15 C54 = CMP-2000-05172-1: Capacitor, Tantalum, 10 uF, +/- 10%, 10 V, -55 to 125 degC, 2-Pin SMD (1206), RoHS, Tape and Reel; Manufacturer Size Code: A; Manufacturer: Kemet; Type: Molded; Online Catalog: T491Series; Other Names: 399-3684-2; Voltage - Rated: 10V; Lifetime @ Temp.: 2000Hrs@85degC; Product Training Modules: CapacitorBasics-TypicalUsesforCapacitorsDeratingGuidelinesforSurfaceMountTantalumCapacitors; ESR (Equivalent Series Resistance): 3.8Ohm; Capacitance: 1uF; Catalog Drawings: T49x,T5xxSeries_A-side1T49x,T5xxSeries_A,B-side2T49x,T5xxSeries_A,SBottom; value: 1uF; Family: TantalumCapacitors; Manufacturer URL: http://www.kemet.com/; Datasheet URL: http://www.farnell.com/datasheets/1824869.pdf; Package Reference: 1206; Packaging: Tape&Reel(TR); Series: T491; Operating Temperature: -55degC~125degC; Mounting Type: SurfaceMount; Height - Seated (Max): 0.071"(1.80mm); Package / Case: 1206(3216Metric); Package Description: 2-Pin Surface Mount Device, Body 3.2 x 1.6 mm; Features: GeneralPurpose; Tolerance: ±10%; Lead Spacing: -; Size / Dimension: 0.126"Lx0.063"W(3.20mmx1.60mm); Standard Package: 2,000; Datasheet Version: Apr-14; Category: Capacitors
C16 C17 C24 C40-C46 C50 C51 C55-C57 C59-C63 = CMP-2000-06213-1: Aluminum Electrolytic Capacitor, 22 uF, +/- 20%, 25 V, 2-Pin SMD (Size Code C), -55 to 105 degC, RoHS, Tape and Reel; Manufacturer: Panasonic; ESR (Equivalent Series Resistance): 0.36O; Ripple Current: 240mA; Capacitance: 220uF; Lifetime@Temperature: 2000Hrs@105°C; Rated Voltage: 25V; Type: Can; value: 220uF; Package Reference: FP-V-C; Package Description: 2-Pin Electrolytic Aluminum Capacitor, Body 5.3 x 5.3 mm; Operating Temp Range: -55to+105°C; Mounting Technology: SurfaceMount; Datasheet URL: http://industrial.panasonic.com/cdbs/www-data/pdf/RDE0000/ABA0000C1184.pdf; Case Size/Dimension: Ø5x5.8mm; Operating Temp-Max: 105°C; Package URL: http://industrial.panasonic.com/cdbs/www-data/pdf/RDE0000/DME0000COL48.pdf; Datasheet Version: 03/2016; Series: FP; Manufacturer URL: http://www.panasonic.com/
C18 = CMP-04424-000013-1: CAP TANT 330UF 10% 10V 2917; Manufacturer Part Number: TAJD337K010RNJ; Manufacturer: AVX Corporation; Esr: 0.9Ω; Dissipation Factor: 8%; Ripple Current: 408mA; Life: 1000Hours; Material: Tantalum; Leakage Current: 33uA; Device Class L3: Tantalum Capacitors; Category: Cap; Lead Free: Yes; Temperature: -55°C to +125°C; Height: 3.1mm; Device Class L2: Capacitors; Temperature Range Low: -55°C; RoHS: TRUE; Capacitance: 100uF; Package: TAJD; Device Class L1: Passive Components; Mouser Description: Cap Tant Solid 330uF 10V D CASE 10% (7.3 X 4.3 X 2.9mm) Inward L SMD 7343-31 0.9 Ohm 125C T/R; Temperature Range High: +125°C; Voltage Rating: 10V; ComponentLink2URL: http://datasheets.avx.com/TAJ.pdf; Automotive: No; Tolerance: 10%; ComponentLink2Description: Datasheet; Value: 330uF; Octopart: https://octopart.com/tajd337k010rnj-avx-9288185; Footprint Url: http://www.avx.com/download/software/literature/AVX-Footprint-Library.pdf; Digikey Description: CAP TANT 330UF 10% 10V 2917
C29 C34 C35 = CMP-2000-05172-1: Capacitor, Tantalum, 10 uF, +/- 10%, 10 V, -55 to 125 degC, 2-Pin SMD (1206), RoHS, Tape and Reel; Manufacturer Size Code: A; Manufacturer: Kemet; Type: Molded; Online Catalog: T491Series; Other Names: 399-3684-2; Voltage - Rated: 10V; Lifetime @ Temp.: 2000Hrs@85degC; Product Training Modules: CapacitorBasics-TypicalUsesforCapacitorsDeratingGuidelinesforSurfaceMountTantalumCapacitors; ESR (Equivalent Series Resistance): 3.8Ohm; Capacitance: 22uF; Catalog Drawings: T49x,T5xxSeries_A-side1T49x,T5xxSeries_A,B-side2T49x,T5xxSeries_A,SBottom; value: 22uF; Family: TantalumCapacitors; Manufacturer URL: http://www.kemet.com/; Datasheet URL: http://www.farnell.com/datasheets/1824869.pdf; Package Reference: 1206; Packaging: Tape&Reel(TR); Series: T491; Operating Temperature: -55degC~125degC; Mounting Type: SurfaceMount; Height - Seated (Max): 0.071"(1.80mm); Package / Case: 1206(3216Metric); Package Description: 2-Pin Surface Mount Device, Body 3.2 x 1.6 mm; Features: GeneralPurpose; Tolerance: ±10%; Lead Spacing: -; Size / Dimension: 0.126"Lx0.063"W(3.20mmx1.60mm); Standard Package: 2,000; Datasheet Version: Apr-14; Category: Capacitors
C53 = CMP-2000-05172-1: Capacitor, Tantalum, 10 uF, +/- 10%, 10 V, -55 to 125 degC, 2-Pin SMD (1206), RoHS, Tape and Reel; Manufacturer Size Code: A; Manufacturer: Kemet; Type: Molded; Online Catalog: T491Series; Other Names: 399-3684-2; Voltage - Rated: 10V; Lifetime @ Temp.: 2000Hrs@85degC; Product Training Modules: CapacitorBasics-TypicalUsesforCapacitorsDeratingGuidelinesforSurfaceMountTantalumCapacitors; ESR (Equivalent Series Resistance): 3.8Ohm; Capacitance: 4.7uF; Catalog Drawings: T49x,T5xxSeries_A-side1T49x,T5xxSeries_A,B-side2T49x,T5xxSeries_A,SBottom; value: 4.7uF; Family: TantalumCapacitors; Manufacturer URL: http://www.kemet.com/; Datasheet URL: http://www.farnell.com/datasheets/1824869.pdf; Package Reference: 1206; Packaging: Tape&Reel(TR); Series: T491; Operating Temperature: -55degC~125degC; Mounting Type: SurfaceMount; Height - Seated (Max): 0.071"(1.80mm); Package / Case: 1206(3216Metric); Package Description: 2-Pin Surface Mount Device, Body 3.2 x 1.6 mm; Features: GeneralPurpose; Tolerance: ±10%; Lead Spacing: -; Size / Dimension: 0.126"Lx0.063"W(3.20mmx1.60mm); Standard Package: 2,000; Datasheet Version: Apr-14; Category: Capacitors
D1 = CMP-02539-000012-1: DIODE SCHOTTKY 40V 3A DO214AB; Manufacturer: Vishay; Max Junction Temp: +150°C; Peak Reverse Current: 0.5mA; Max Surge Forward Current: 100A; Standoff Height: 0mm; ComponentLink2Description: Datasheet; Device Class L3: Schottky Diodes; Height: 2.62mm; Max Repetitive Reverse Voltage: 40V; Lead Free: Yes; Package: 95402; Temperature Range High: +150°C; ComponentLink2URL: http://www.vishay.com/docs/88751/ss32.pdf; Temperature: -55°C to +150°C; Footprint Url: http://www.vishay.com/docs/95402/smc.pdf; Automotive: No; Forward Current: 3A; Category: Diode; Manufacturer Part Number: SS34-E3/57T; RoHS: TRUE; Device Class L2: Diodes; Mouser Description: Schottky Diodes & Rectifiers 3.0 Amp 40 Volt; Octopart: https://octopart.com/ss34-e3%2F57t-vishay-39552907; Temperature Range Low: -55°C; Device Class L1: Discrete Semiconductors; Digikey Description: DIODE SCHOTTKY 40V 3A DO214AB
D2 D3 = CMP-12828-000012-1: TVS DIODE 5V 9.2V SMB; Manufacturer: Diodes Inc; Peak Pulse Power: 600W; Direction: Bidirectional; Max Junction Temp: +150°C; Number Of Channels: 1; Peak Pulse Current: 65.2A; Breakdown Voltage: 6.4V; Standoff Height: 0.05mm; Device Class L2: TVS Diodes; Temperature: -55°C to +150°C; Digikey Description: TVS DIODE 5V 9.2V SMB; Manufacturer Part Number: SMBJ5.0CA-13-F; Octopart: https://octopart.com/smbj5.0ca-13-f-diodes+inc.-13025192; Mouser Description: TVS Diodes - Transient Voltage Suppressors 600W 5.0V; Temperature Range Low: -55°C; Reverse Standoff Voltage: 5V; Category: Diode; Lead Free: Yes; Device Class L3: unset; Footprint Url: https://www.diodes.com/assets/Package-Files/SMB.pdf; Clamping Voltage: 9.2V; Package: SMB-CA; Height: 2.5mm; Temperature Range High: +150°C; ComponentLink2Description: Datasheet; ComponentLink2URL: https://www.diodes.com/assets/Datasheets/ds19002.pdf; Automotive: No; Device Class L1: Circuit Protection; RoHS: TRUE
FB2 = CMP-0686-00699-2: Chip Ferrite Bead for High Digital Interface Lines, 120 Ohm, 200 mA, -55 to 125 degC, 2 x 1.25 x 1.05 mm SMD, Tape and Reel; Manufacturer: Murata; Rated Current: 200 mA; Impedance (at 100 MHz): 120 Ohm +/- 25%; DC Resistance: 0.15 Ohm Max.; ComponentLink1Description: Manufacturer URL; ComponentLink3Description: Package Specification; ComponentLink3URL: http://www.murata.com/products/catalog/pdf/c31e.pdf; Mounting Technology: Surface Mount; DatasheetVersion: 08/2013; PackageDescription: 2-Pin Chip, Body 2 x 1.25 mm; ComponentLink2Description: Datasheet; PackageReference: BLM21_H1050-2; Operating Temperature Range: -55 to 125 degC; ComponentLink2URL: http://www.murata.com/products/catalog/pdf/c31e.pdf; Packing: Tape and Reel; PartNumber: BLM21RK121SN1D; ComponentLink1URL: http://www.murata.com/
J1-J4 = CMP-1023-00427-1: SQ Post Socket, Through-hole, Vertical, -55 to 105 degC, 2.54 mm Pitch, 14-Pin, Female, RoHS; Manufacturer: Samtec; Pitch: 2.54 mm; DatasheetVersion: F-214; ComponentLink1URL: http://www.samtec.com; ComponentLink1Description: Manufacturer URL; PackageDescription: Assembly, Socket Strip .016 X .031 Tail; ComponentLink2URL: http://www.samtec.com/documents/webfiles/pdf/SSW_TH.PDF; ComponentLink3URL: http://www.samtec.com/documents/webfiles/cpdf/SSW-1XX-XX-XXX-X-XX-XXX-XX-MKT.pdf; ComponentLink3Description: Package Specification; Temperature Range: -55 to 105 degC; Mounting Technology: Through-hole; PackageReference: SSW-114-01-X-S; ComponentLink2Description: Datasheet; PartNumber: SSW-114-01-T-S; RoHS: True; PackageVersion: CA, 6/1987; Orientation: Vertical
J5 = CMP-2000-06841-1: Jack Socket, Body 14.5 x 9 mm, Height 11 mm, -20 to 70 degC, 3-Pin THD, RoHS, Bulk; Manufacturer: Lumberg; Body Orientation: RightAngle; Voltage Rating: 12Vdc; Current Rating: 3A; Maximum Operating Temperature: +70°C; Mounting Technology: ThroughHole; Termination Method: Solder; Package Description: 3-Pin Through Hole Device, Body 14.5 x 9 mm, Height 11 mm; Datasheet URL: https://datasheet.ciiva.com/11720/0900766b805694d6-11720273.pdf; Datasheet Version: 12/2004; Package Reference: NEB21R; Manufacturer URL: http://www.lumberg.com/; Plug/Socket: Socket; Mounting Type: ThroughHole; Minimum Operating Temperature: -20°C
J6 = CMP-2000-05417-1: Male Header, Pitch 2.54 mm, 1 x 2 Position, Height 10.49 mm, Tail Length 3.556 mm, -55 to 105 degC, RoHS, Bulk; Manufacturer: TE Connectivity; Standards: RoHSCompliant,ELVCompliant,UL94V-0; Material, Housing: Polyester; Agency Approvals: CSA,UL; Brand/Series: MTA-100Series; Contact Centerline Spacing: 0.100 / in.; Material, Contact: CopperAlloy; Current, Rating: 5 / A; Color, Housing: White; Contact Termination Area Plating: Tin; Special Features: Pinstrip; Number of Positions: 2; Pin Spacing: 0.1 / "; Temperature, Operating: -55to+105 / degC; Angle: Straight; Mount Angle: Vertical; Connector Type: MTA-100; Primary Type: InterconnectSystem; Voltage, Rating: 250 / V; Mounting Hole Size: 0.04 / "; Number of Rows: 1; Termination: Solder; Length, Terminal Post: 0.14 / in.; Manufacturer URL: http://www.te.com/; Color: White; Size, Post: 0.025 / in.; Contact Shape: Square; Mounting Type: PCMount; Datasheet URL: https://datasheet.ciiva.com/11746/0900766b80eb7fdd-11746365.pdf; Type: PCBPlug; Datasheet Version: Rev. W, 06/2004; Number of Contacts: 2; Flammability Rating: UL94V-0; Contact Plating: Tin; Length, Pin: 0.14 / "; Contact Mating Area Plating: Tin; Length, Overall: 0.2 / "
L1 L2 = CMP-02424-000538-1: Commercial Inductors, High Saturation Series 4.7uH 5.5A 40mΩ 20%; DC Resistance (DCR): 40mR; Max DC Current: 10A; Inductance: 15uH; Shielding: Shielded; Test Frequency: 100kHz; Self Resonant Frequency: 5MHz; Core Material: Metal; value: 15uH; Height: 3mm; Depth: 6.72mm; Inductance Tolerance: 20%; Number of Pins: 2; Military Standard: Not; Min Operating Temperature: -55°C; Mount: Surface Mount; Saturation Current: 10A; Case/Package: 2525; Case Code (Metric): 6363; Packaging: Tape and Reel; Width: 0.255inch; Current Rating: 5.5A; Package Quantity: 2000; Termination: SMD/SMT; Case Code (Imperial): 2525; Lead Free: Lead Free; Contact Plating: Tin; Max Operating Temperature: 125°C; Tolerance: 20%; Length: 7.24mm; Radiation Hardening: No; Height - Seated (Max): 0.118inch; RMS Current (Irms): 5.5A
LED1 LED2 = CMP-1426-00010-1: SMD mono-color Chip LED, WL-SMCW, Super Red; Manufacturer: Wuerth Elektronik; PackageReference: 0805_A; ComponentLink2URL: http://katalog.we-online.com/led/datasheet/150080SS75000.pdf; ComponentLink1URL: http://www.we-online.com; Color: Super Red; ComponentLink2Description: Datasheet; ComponentLink1Description: Manufacturer URL; PartNumber: 150080SS75000
P1 P2 = CMP-1502-02171-1: Serie 312 - 5.08mm Open Horizontal PCB Header WR-TBL, 4 pin; Manufacturer: Wurth Elektronik; Pin Number: 4; Gender: Male; Part Number: 691312510004; Publisher: WurthElektronik; Operating Temperature: -40to105degC; Packaging: Box; Mounting Technology: THT; Datasheet URL: http://katalog.we-online.de/em/datasheet/6913125100xx.pdf; Manufacturer URL: http://www.we-online.de; Pitch: 5.08mm; Package Reference: 691312510004
P3 = CMP-1502-02175-1: Serie 312 - 5.08mm Open Horizontal PCB Header WR-TBL, 8 pin; Manufacturer: Wurth Elektronik; Gender: Male; Pin Number: 8; Package Reference: 691312510008; Manufacturer URL: http://www.we-online.de; Publisher: WurthElektronik; Operating Temperature: -40to105degC; Packaging: Box; Mounting Technology: THT; Part Number: 691312510008; Pitch: 5.08mm; Datasheet URL: http://katalog.we-online.de/em/datasheet/6913125100xx.pdf
P4-P7 = CMP-1502-00584-1: Male Locking Header WR-WTB, THT, Vertical, pitch 2.54 mm, 1 x 2 position; Manufacturer: Wurth Elektronik; Position: 1x2; Contact Resistance: 20mOhm; Working Voltage: 250VAC; Pitch: 2.54mm; Gender: Male; Part Number: 61900211121; Mounting Technology: THT; Operating Temperature: -40to105degC; Orientation: Vertical; Packaging: Bag; Package Reference: 61900211121; Manufacturer URL: http://www.we-online.de; Datasheet URL: https://katalog.we-online.de/em/datasheet/6190xx11121.pdf; Publisher: WurthElektronik
P10 = Header 5: Header, 5-Pin; LatestRevisionDate: 17-Jul-2002; LatestRevisionNote: Re-released for DXP Platform.; Publisher: Altium Limited
Q1 Q2 Q4 Q10 Q11 Q14-Q18 = CMP-18400-000015-1: OPTOISO 3.75KV OPN COLL 8DIP GW; Manufacturer: Broadcom; Min Supply Voltage: 4.5V; Forward Voltage: 1.5V; Turn Off Delay Time: 50ns; Standoff Height: 0.505mm; Reverse Voltage: 5V; Isolation Voltage: 3750Vrms; Forward Current: 10mA; Turn On Delay Time: 48ns; Max Supply Voltage: 5.5V; Package: 0; Automotive: No; Lead Free: Yes; ComponentLink2Description: Datasheet; Temperature: -40°C to +85°C; Device Class L3: unset; Height: 4.455mm; Ambient Temperature Range Low: -40°C; Digikey Description: OPTOISO 3.75KV OPN COLL 8DIP GW; Temperature Range Low: -40°C; ComponentLink2URL: https://docs.broadcom.com/docs/AV02-0940EN; Mouser Description: High Speed Optocouplers 10 Mb/s 3750Vrms; Category: Trans; Ambient Temperature Range High: +85°C; RoHS: TRUE; Octopart: https://octopart.com/6n137-300e-broadcom-71125550; Manufacturer Part Number: 6N137-300E; Device Class L1: Optoelectronics; Device Class L2: Optocouplers; Temperature Range High: +85°C
Q3 Q12 Q19 = CMP-2000-04985-1: N-Channel HEXFET(R) Power MOSFET, 20 V VDS, +/- 12 V VGS, 4.2 A, 3-Pin SOT23, RoHS, Tape and Reel; Manufacturer: International Rectifier; Drain-to-Source Voltage [Vdss]: 20V; Drain-Source On Resistance-Max: 0.045O; Qg Gate Charge: 8nC; Rated Power Dissipation: 1.25W; Package Reference: SOT-23-3; Manufacturer URL: http://internationalrectifier.com/; Package Description: 3-Pin Small Outline Transistor, Body 2.92 x 1.3 mm, Pitch 0.95 mm; Datasheet Version: Apr-14; Channel Type: N-Channel; Datasheet URL: https://datasheet.ciiva.com/6383/irlml2502pbf-6383216.pdf
Q5-Q9 Q13 = STL120N4LF6AG: N-Channel 40V 120A (Tc) 96W (Tc) Surface Mount PowerFlat™ (5x6)
R1-R20 R25-R80 R83-R85 R? = CMP-1659-00013-4: Chip Resistor, 10 KOhm, +/- 1%, 0.125 W, -55 to 155 degC, 0805 (2012 Metric), RoHS, Tape and Reel; Manufacturer: Yageo; Voltage Rating: 150 V; Mount: Surface Mount; ComponentLink1Description: Manufacturer URL; ComponentLink2URL: http://www.yageo.com/documents/recent/PYu-RC_Group_51_RoHS_L_04.pdf; Pins: 2; Length: 2 mm; Min Operating Temperature: -55 degC; Height: 0.5 mm; Mounting Technology: Surface Mount; RoHSCompliant: true; REACH SVHC: No SVHC; ComponentLink1URL: http://www.yageo.com/; Max Operating Temperature: 155 degC; PackageReference: 0805; DatasheetVersion: Rev. 4, 02/2016; Package Quantity: 5000; Packaging: Tape and Reel; ComponentLink2Description: Datasheet; PackageDescription: 2-Pin Surface Mounted Device, Body 2 x 1.25 mm
  R1 R2 R4 R9 R11 R18 R20 R38 R41 R43 R62 R64 R66 R68: Value: 390
  R3 R8 R10 R37 R40 R42 R52 R53 R61 R63 R65 R67: Value: 220
  R5 R54: Value: 100k
  R6: Value: 22k
  R7 R25 R34-R36 R39 R56-R59 R70: Value: 10k
  R12 R19 R44 R51: Value: 3.3k
  R13-R17 R45-R49: Value: 1k
  R26: Value: 100
  R27-R29 R31-R33 R50 R69: Value: 5.6k
  R30 R85: Value: 560
  R55: Value: 500
  R60 R71-R79 R83 R84: Value: 0
  R80: Value: 5k
  R?: Value: 13k
R21-R24 = CMP-1678-00003-4: Axial Resistor, 5 mOhm, +/- 1%, 2 W, -55 to 275 degC, 2-Pin THD, RoHS, Bulk; Manufacturer: Ohmite; Voltage Rating: 100 mV; Packaging: Bulk; Pins: 2; DatasheetVersion: 06/2015; Length: 10.6 mm; REACH SVHC: Unknown; PackageDescription: 2-Pin Axial Lead, Dia 2.4 mm, Body Length 10.6 mm; ComponentLink1Description: Manufacturer URL; Mount: Through Hole; ComponentLink2Description: Datasheet; ComponentLink1URL: http://www.ohmite.com/; Min Operating Temperature: -55 degC; ComponentLink2URL: http://www.ohmite.com/cat/res_10.pdf; Max Operating Temperature: 275 degC; Package Quantity: 10; Mounting Technology: Through Hole; RoHSCompliant: true; PackageReference: Axial Resistor
RESET1 SW5-SW8 = CMP-1460-00001-1: WS-TASV J-Bend SMD Tact Switch 6.0X3.8 mm; Manufacturer: Wuerth Elektronik; NoPins: 02; ComponentLink1Description: Manufacturer URL; ComponentLink2Description: Datasheet; PartNumber: 434113025826; ComponentLink1URL: http://www.we-online.com; ComponentLink2URL: http://katalog.we-online.de/em/datasheet/434113025826.pdf; PackageReference: 434113025826
U1 = CMP-0237-00142-3: ARM Cortex-M3 32-bit MCU, 64 KB Flash, 8 KB Internal RAM, 37 I/Os, 48-pin LQFP, -40 to 85 degC, Tray; D/A Converter: 2x12-bit (2 Channel); Internal RAM Size (kB): 8; Supply Voltage(Vcc) min (V): 2; Operating Frequency(F) (Processor speed) (MHz): 24; A/D Converter: 1x12-bit (10 Channel); I/Os (High Current): 37; FLASH Size (Prog) (kB): 64; DatasheetVersion: Rev. 7; ComponentLink2Description: Datasheet; Core: ARM Cortex-M3; ComponentLink3Description: Package Specification; Mounting Technology: Surface Mount; PartNumber: STM32F100C8T6B; PackageReference: LQFP48; ComponentLink3URL: http://www.st.com/st-web-ui/static/active/en/resource/technical/document/datasheet/DM00058181.pdf; PackageDescription: 48-Pin Low Profile Quad Flat Package, 7 x 7 mm Body, 0.5 mm Pitch; ComponentLink1Description: Manufacturer URL; PackageVersion: Rev. 6, 06/2013; ComponentLink2URL: http://www.st.com/st-web-ui/static/active/en/resource/technical/document/datasheet/CD00251732.pdf; Packing: Tray; ComponentLink1URL: http://www.st.com/web/en/home.html
U2 U10 = CMP-04918-000098-1: IC REG BUCK ADJ 3A TSOT23-6; Manufacturer: Texas Instruments; Max Duty Cycle: 100%; Standoff Height: 0mm; Max Junction Temp: +125°C; Min Supply Voltage: 4.5V; Nominal Supply Current: 45uA; Output Voltage: 0.6-26V; Max Supply Voltage: 28V; Output Type: AdjustableProgrammable; Number Of Outputs: 1; Switching Frequency: 400kHz; Temperature Range High: +125°C; Switching Topology: Buck; Device Class L3: Voltage Regulators - Switching; Device Class L2: Power Management ICs; Lead Free: Yes; Height: 1.1mm; Package: DDC0006A; ComponentLink2Description: Datasheet; Device Class L1: Integrated Circuits (ICs); Manufacturer Part Number: TPS54302DDCT; Output Current: 3A; ComponentLink2URL: http://www.ti.com/lit/ds/symlink/tps54302.pdf; Automotive: No; Digikey Description: IC REG BUCK ADJ 3A TSOT23-6; Octopart: https://octopart.com/tps54302ddct-texas+instruments-74209026; RoHS: TRUE; Category: IC; Temperature Range Low: -40°C; Temperature: -40°C to +125°C
U3 U9 = VNH5019A: Automotive fully integrated H-bridge motor driver
U4-U7 = CMP-2000-05026-1: Intelligent Control LED Integrated Light Source, 3.5 to 5.3 V, -25 to 80 degC, 4-Pin SMD, RoHS, Tape and Reel; Manufacturer: Adafruit-Industries-LLC; Number of LEDs: 10; Configuration: Discrete; Datasheet URL: http://datasheet.octopart.com/ADA1655-Adafruit-Industries-datasheet-32028139.pdf; Series: Neopixel; Interface: -; Package Description: 4-Pin Surface Mount Device, Body 5 x 5 mm; Utilized LED: WS2812(5050); Color: Red,Green,Blue(RGB); Category: Optoelectronics; Controller Type: -; Package Reference: 1655; Manufacturer URL: https://www.adafruit.com/; Mounting Type: SurfaceMount; Datasheet Version: May-13; Size / Dimension: 5.00mmLx5.00mmW; Family: Addressable,Specialty
U8 = CMP-209535-000001-1: LDO Voltage Regulators 1A, 3.3V; Manufacturer: Advanced Monolithic Systems; Dropout Voltage: 1.1V; Output Type: Fixed; Nominal Supply Current: 5mA; Max Power Dissipation: 1.2W; Max Supply Voltage: 15V; Number Of Outputs: 1; Standoff Height: 0.64mm; Max Junction Temp: +125°C; Height: 1.8mm; Package: AMS1117; Device Class L2: Power Management ICs; ComponentLink2Description: Datasheet; ComponentLink2URL: http://www.advanced-monolithic.com/pdf/ds1117.pdf; Category: IC; RoHS: TRUE; Automotive: No; Device Class L1: Integrated Circuits (ICs); Output Current: 1A; Device Class L3: Voltage Regulators - Linear; Temperature: -40°C to +125°C; Output Voltage: 3.3V; Manufacturer Part Number: AMS1117-3.3; Temperature Range Low: -40°C; Octopart: https://octopart.com/ams1117-3.3-advanced+monolithic+systems-25899300; Lead Free: Yes; Ipc Land Pattern Name: SOT229P700X180-4; Temperature Range High: +125°C
X1 = CMP-0585-00002-2: ATS-SM Series Quartz Crystal, 16 MHz, -20 to 70 degC, 11.1 x 4.83 x 4.3mm SMD, RoHS, Tape and Reel; Manufacturer: CTS Corporation; Shunt Capacitance (C0): 7.0 pF Max; Frequency: 16 MHz; Oscillation Mode: Fundamental or 3rd Overtone; Crystal Cut: AT-Cut; ESR Maximum: 40 Ohms; Drive Level (Type): 100 uW; PackageDescription: 2-Pin SMD, Body 11.1 x 4.83 mm, Pitch 8.5 mm; PackageReference: ATS-SM-XTAL-2; ComponentLink1URL: http://www.ctscorp.com/; PartNumber: ATS16ASM-1; RoHS: TRUE; ComponentLink1Description: Manufacturer URL; Operating Temperature: -20 to 70 degC; DatasheetVersion: Rev. K; ComponentLink2Description: Datasheet; Packing: Tape and Reel; ComponentLink2URL: http://www.ctscorp.com/components/Datasheets/008-0309-0.pdf; Mounting Technology: Surface Mount; ComponentLink3URL: http://www.ctscorp.com/components/Datasheets/008-0309-0.pdf; ComponentLink3Description: Package Specification
Y1 = CMP-18717-000007-1: CRYSTAL 32.7680KHZ 7PF SMD; Tolerance: 20ppm; Frequency: 32.768kHz; ESR (Equivalent Series Resistance): 70kR; Case/Package: SMD/SMT; Load Capacitance: 7pF; Mount: Surface Mount; Package Quantity: 1; REACH SVHC: No SVHC; Packaging: Tape and Reel; Number of Pins: 2; Termination: SMD/SMT; Length: 0.126inch; Width: 1.5mm; Height: 0.033inch; Max Operating Temperature: 85°C; Lead Free: Lead Free; Min Operating Temperature: -40°C; Frequency Tolerance: 20ppm
P8 P9 = Plug: LatestRevisionDate: 17-Jul-2002; LatestRevisionNote: Re-released for DXP Platform.; Publisher: Altium Limited